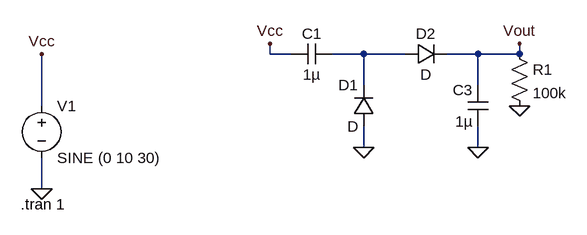
[diagram p0: schematic half_bridge.asc]
half_bridge.asc, the LTspice schematic file:
Version 4
SHEET 1 880 680
WIRE 416 48 416 32
WIRE 448 48 416 48
WIRE 560 48 512 48
WIRE 624 48 560 48
WIRE 736 48 688 48
WIRE 800 48 800 32
WIRE 800 48 736 48
WIRE 560 96 560 48
WIRE 736 96 736 48
WIRE 64 128 64 48
WIRE 560 192 560 160
WIRE 736 192 736 160
WIRE 64 256 64 208
FLAG 64 256 0
FLAG 64 48 Vcc
FLAG 800 32 Vout
FLAG 560 192 0
FLAG 736 192 0
FLAG 416 32 Vcc
FLAG 800 128 0
SYMBOL voltage 64 112 R0
WINDOW 123 0 0 Left 0
WINDOW 39 0 0 Left 0
SYMATTR InstName V1
SYMATTR Value SINE (0 10 30)
SYMBOL cap 512 32 R90
WINDOW 0 0 32 VBottom 2
WINDOW 3 32 32 VTop 2
SYMATTR InstName C1
SYMATTR Value 1µ
SYMBOL diode 576 160 R180
WINDOW 0 24 64 Left 2
WINDOW 3 24 0 Left 2
SYMATTR InstName D1
SYMBOL cap 752 160 R180
WINDOW 0 24 56 Left 2
WINDOW 3 24 8 Left 2
SYMATTR InstName C3
SYMATTR Value 1µ
SYMBOL diode 624 64 R270
WINDOW 0 32 32 VTop 2
WINDOW 3 0 32 VBottom 2
SYMATTR InstName D2
SYMBOL res 784 32 R0
SYMATTR InstName R1
SYMATTR Value 100k
TEXT 32 280 Left 2 !.tran 1

The netlist it stands for:
* half_bridge.asc
V1 Vcc 0 SINE (0 10 30)
C1 N001 Vcc 1µ
D1 0 N001 D
C3 0 Vout 1µ
D2 N001 Vout D
R1 Vout 0 100k
.model D D
.lib standard.dio
.tran 1
.backanno
.end